# Altium schematic sheet tie-mib-term1.SchDoc: Copper Suicide - Net Tie MIBT1
size Letter; CheckedBy: J. Brinton; CompanyName: Signal Laboratories, Inc.; DrawnBy: J. Brinton; Engineer: J. Brinton; Address1: 3479 Edison Way; Address2: Menlo Park CA 94025; Address3: +1 (877) 778-8435; Address4: siglabs.com; Revision: 3; SheetNumber: 32; SheetTotal: 47
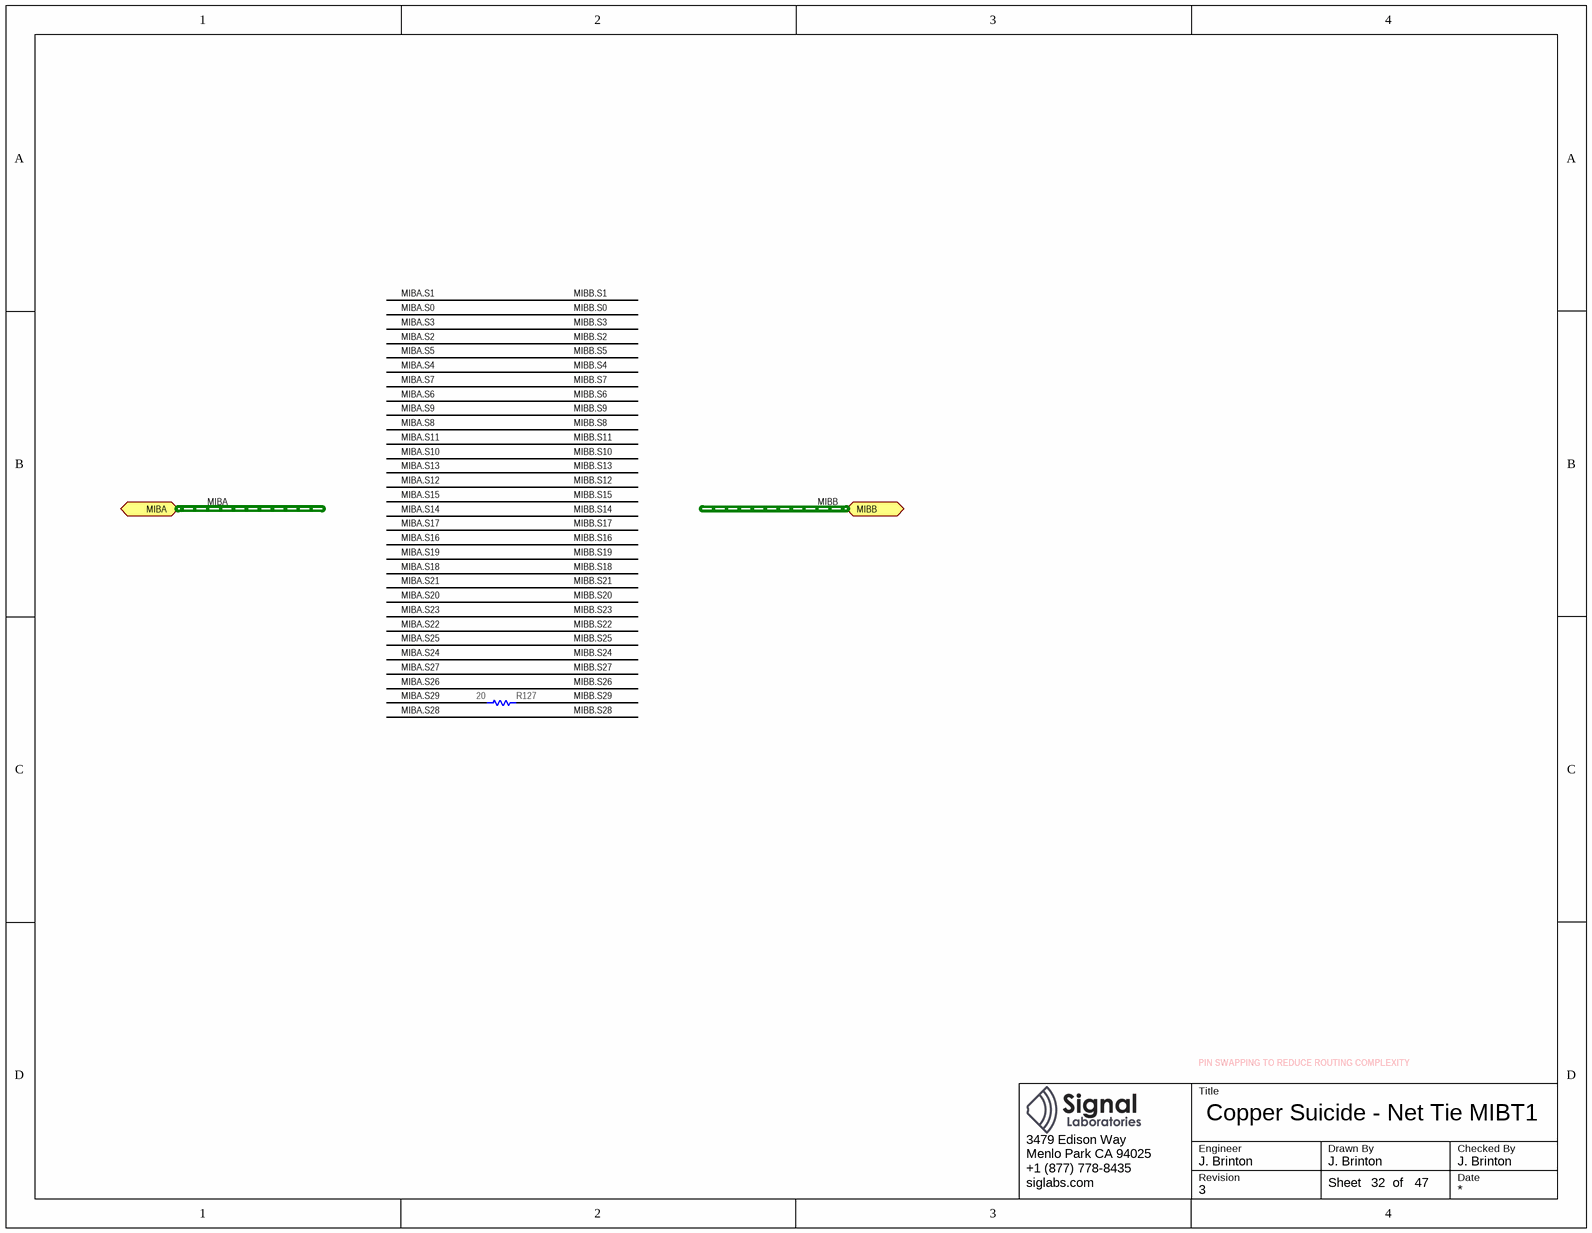
[diagram p0: tie-mib-term1.SchDoc]

## Parts
R127  value 20  [RESC1005X40N]  (hidden comment: ERJ-2RKF20R0X)

## Ports
MIBA (harness MIB), MIBB (harness MIB)

## Nets
MIBA.S29: R127.1
MIBB.S29: R127.2

## Buses and harness runs
harness MIBA = port MIBA
harness MIBB = port MIBB

## Notes on the sheet
- PIN SWAPPING TO REDUCE ROUTING COMPLEXITY
- Title
- Engineer
- Revision
- Drawn By
- Checked By
- Date
- Sheet
- of

## Library data of the parts
R127 = RES: Thick Film Resistor 20 ±1% 0.1W 75V 0402; Manufacturer: Panasonic; Tcr: ±100; Tr: -55:155; Voltage: 75; Power: 0.1; Tolerance: ±1%; Manufacturer P/N: ERJ-2RKF20R0X; Alternatives: *; Footprint: *; Package: 0402